# EAGLE schematic iterasi1 (EAGLE 9.5.1)
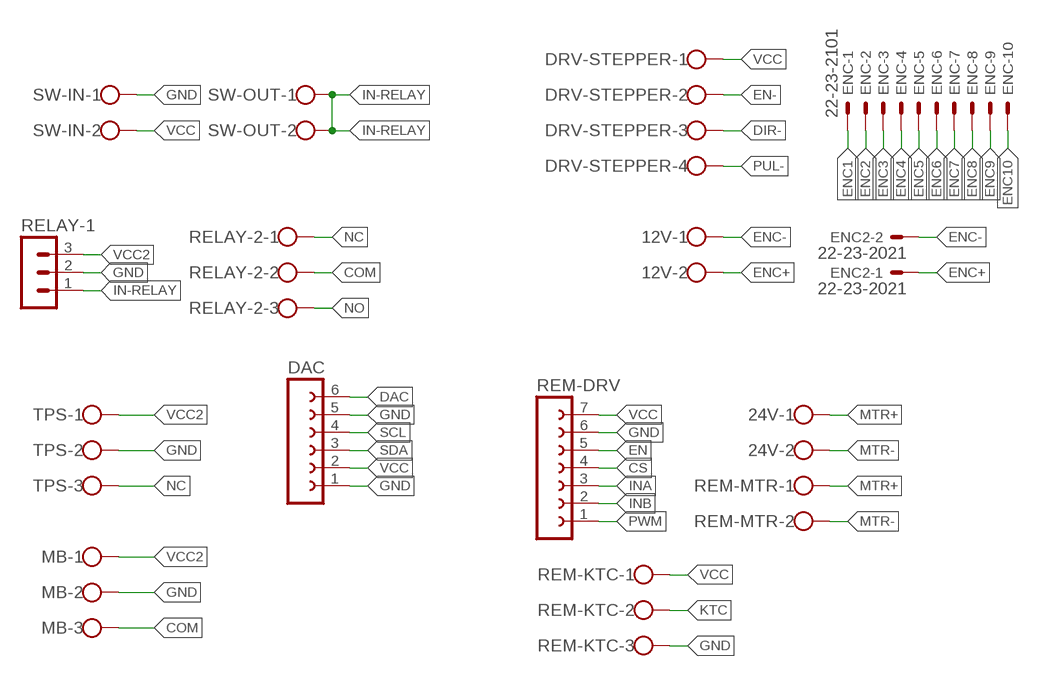
[diagram p0: schematic, sheet 1]

## Parts
12V  W237-102  [W237-102]
24V  W237-102  [W237-102]
DAC  FE06-1  [FE06]
DRV-STEPPER  W237-4  [W237-4]
ENC  22-23-2101  [22-23-2101]
ENC2  22-23-2021  [22-23-2021]
MB  W237-103  [W237-103]
RELAY-1  MA03-1  [MA03-1]
RELAY-2  W237-103  [W237-103]
REM-DRV  FE07-1  [FE07]
REM-KTC  W237-103  [W237-103]
REM-MTR  W237-102  [W237-102]
SW-IN  W237-102  [W237-102]
SW-OUT  W237-102  [W237-102]
TPS  W237-103  [W237-103]

## Nets
COM: MB.3 RELAY-2.2
CS: REM-DRV.4
DAC: DAC.6
DIR-: DRV-STEPPER.3
EN: REM-DRV.5
EN-: DRV-STEPPER.2
ENC1: ENC.1
ENC2: ENC.2
ENC3: ENC.3
ENC4: ENC.4
ENC5: ENC.5
ENC6: ENC.6
ENC7: ENC.7
ENC8: ENC.8
ENC9: ENC.9
ENC10: ENC.10
ENC+: 12V.2 ENC2.1
ENC-: 12V.1 ENC2.2
GND: DAC.1 DAC.5 MB.2 RELAY-1.2 REM-DRV.6 REM-KTC.3 SW-IN.1 TPS.2
IN-RELAY: RELAY-1.1 SW-OUT.1 SW-OUT.2
INA: REM-DRV.3
INB: REM-DRV.2
KTC: REM-KTC.2
MTR+: 24V.1 REM-MTR.1
MTR-: 24V.2 REM-MTR.2
NC: RELAY-2.1 TPS.3
NO: RELAY-2.3
PUL-: DRV-STEPPER.4
PWM: REM-DRV.1
SCL: DAC.4
SDA: DAC.3
VCC: DAC.2 DRV-STEPPER.1 REM-DRV.7 REM-KTC.1 SW-IN.2
VCC2: MB.1 RELAY-1.3 TPS.1

## Library data of the parts
12V 24V REM-MTR SW-IN SW-OUT = con-wago-500:W237-102: WAGO SCREW CLAMP; MPN: 237-102; OC_FARNELL: unknown; OC_NEWARK: 70K9898
DAC = con-lsta:FE06-1: FEMALE HEADER; OC_FARNELL: unknown; OC_NEWARK: unknown
DRV-STEPPER = con-wago-500:W237-4: WAGO SCREW CLAMP; OC_FARNELL: unknown; OC_NEWARK: unknown
ENC = con-molex:22-23-2101: .100" (2.54mm) Center Header - 10 Pin; MF: MOLEX; MPN: 22-23-2101; OC_FARNELL: 1756828; OC_NEWARK: 94C0765
ENC2 = con-molex:22-23-2021: .100" (2.54mm) Center Header - 2 Pin; MF: MOLEX; MPN: 22-23-2021; OC_FARNELL: 1462926; OC_NEWARK: 25C3832
MB RELAY-2 REM-KTC TPS = con-wago-500:W237-103: WAGO SCREW CLAMP; MPN: 237-103; OC_FARNELL: unknown; OC_NEWARK: 18M7116
RELAY-1 = con-lstb:MA03-1: PIN HEADER; OC_FARNELL: unknown; OC_NEWARK: unknown
REM-DRV = con-lsta:FE07-1: FEMALE HEADER; OC_FARNELL: unknown; OC_NEWARK: unknown